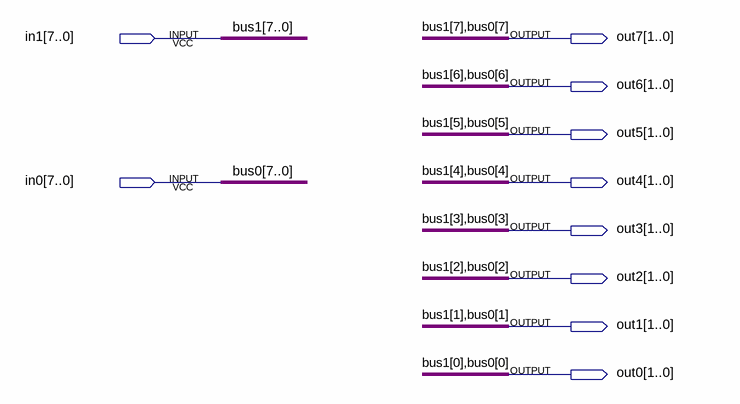
[diagram p0: schematic sheet]
// Quartus schematic 8x2to2x8.bdf as structural Verilog: 0 symbols, 10 pins
module \8x2to2x8  (
  input  [7:0] in1,
  input  [7:0] in0,
  output [1:0] out7,
  output [1:0] out6,
  output [1:0] out5,
  output [1:0] out4,
  output [1:0] out3,
  output [1:0] out2,
  output [1:0] out1,
  output [1:0] out0
);


  assign out0 = {in1[0], in0[0]};
  assign out1 = {in1[1], in0[1]};
  assign out2 = {in1[2], in0[2]};
  assign out3 = {in1[3], in0[3]};
  assign out4 = {in1[4], in0[4]};
  assign out5 = {in1[5], in0[5]};
  assign out6 = {in1[6], in0[6]};
  assign out7 = {in1[7], in0[7]};

  // Other names for the same wires on the sheet: bus0[7:0] = in0; bus1[7:0] = in1
endmodule
